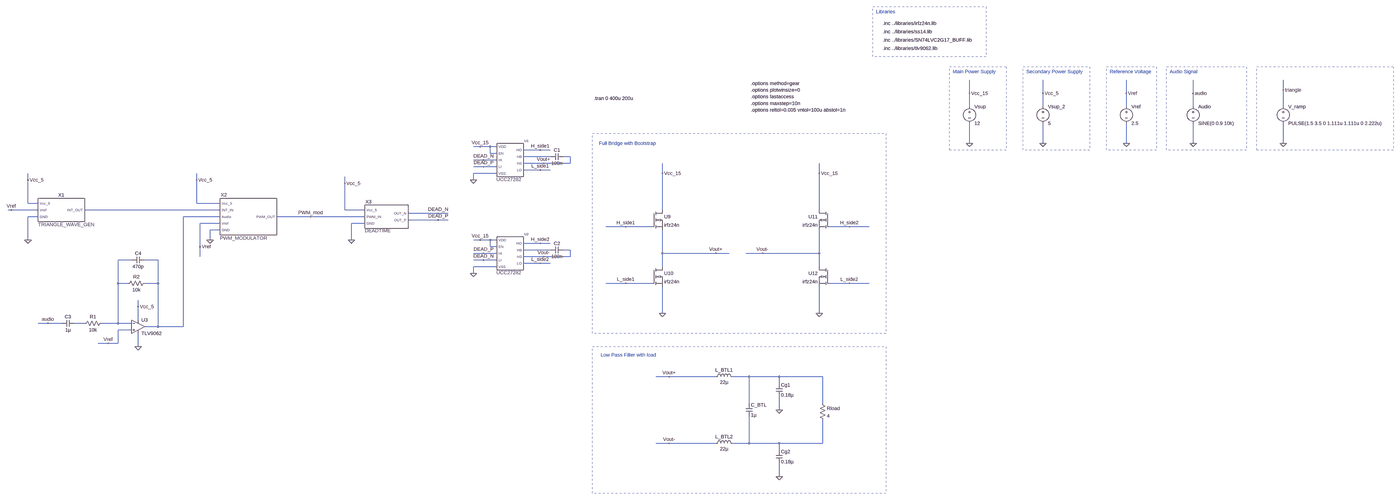
[diagram p0: schematic Top.asc, whole sheet]
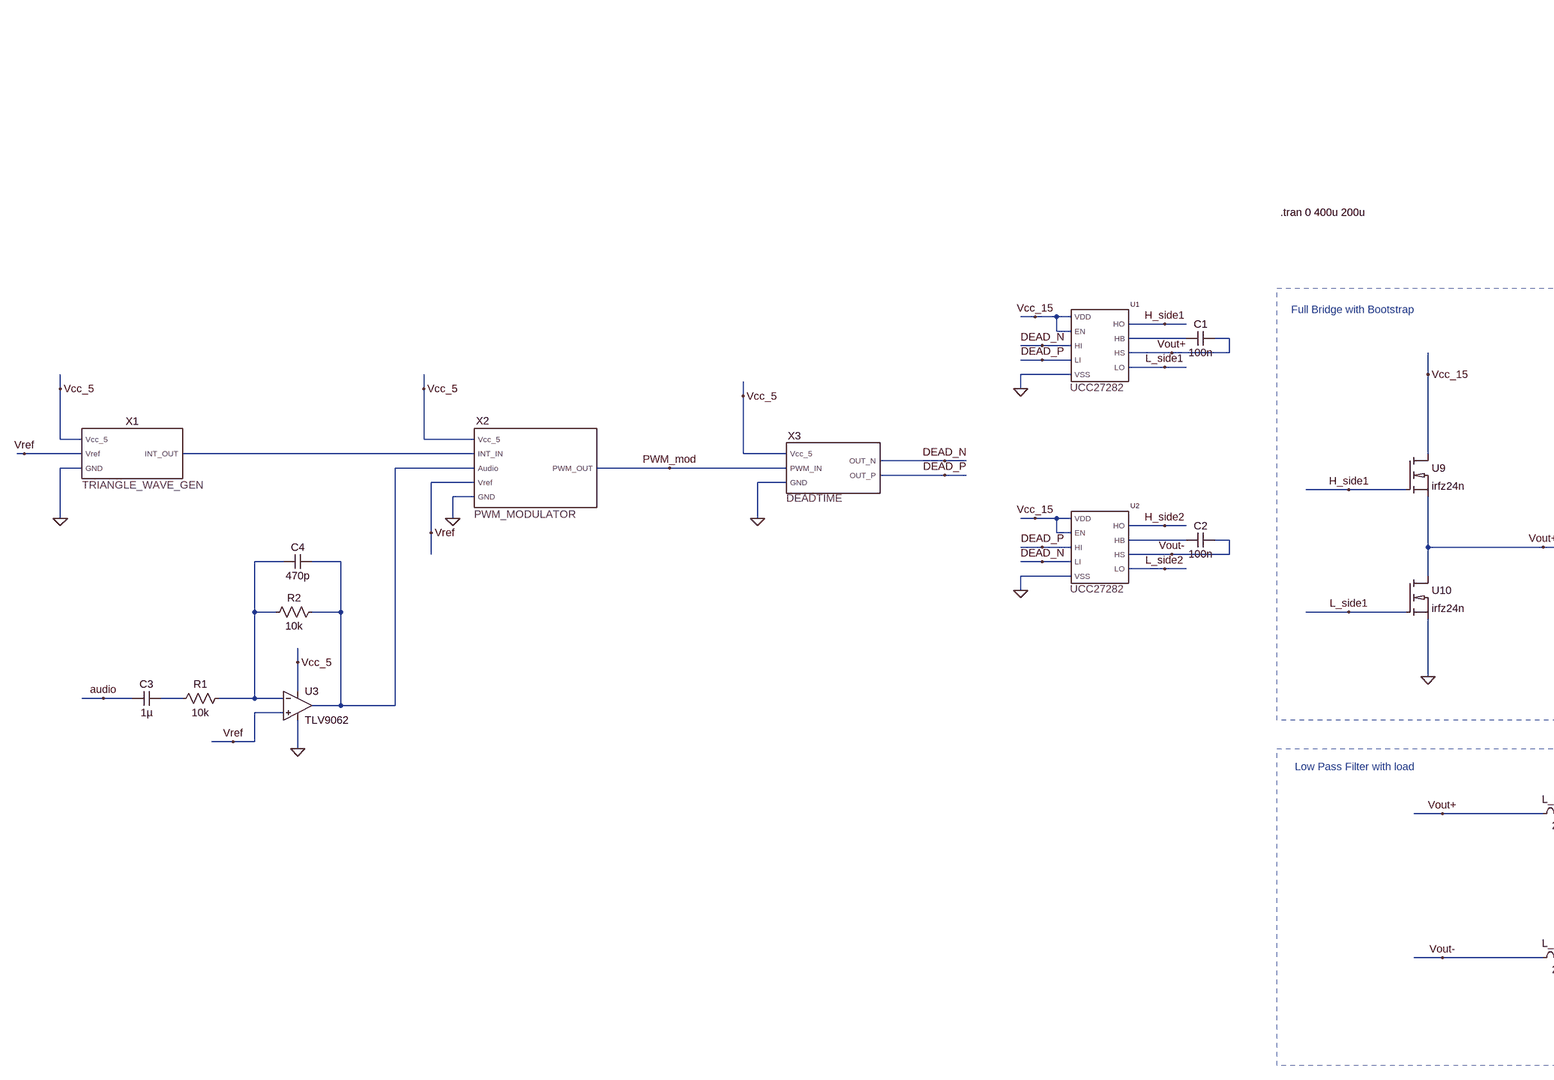
[diagram p1: schematic Top.asc, part, row 1 of 1, column 1 of 2]
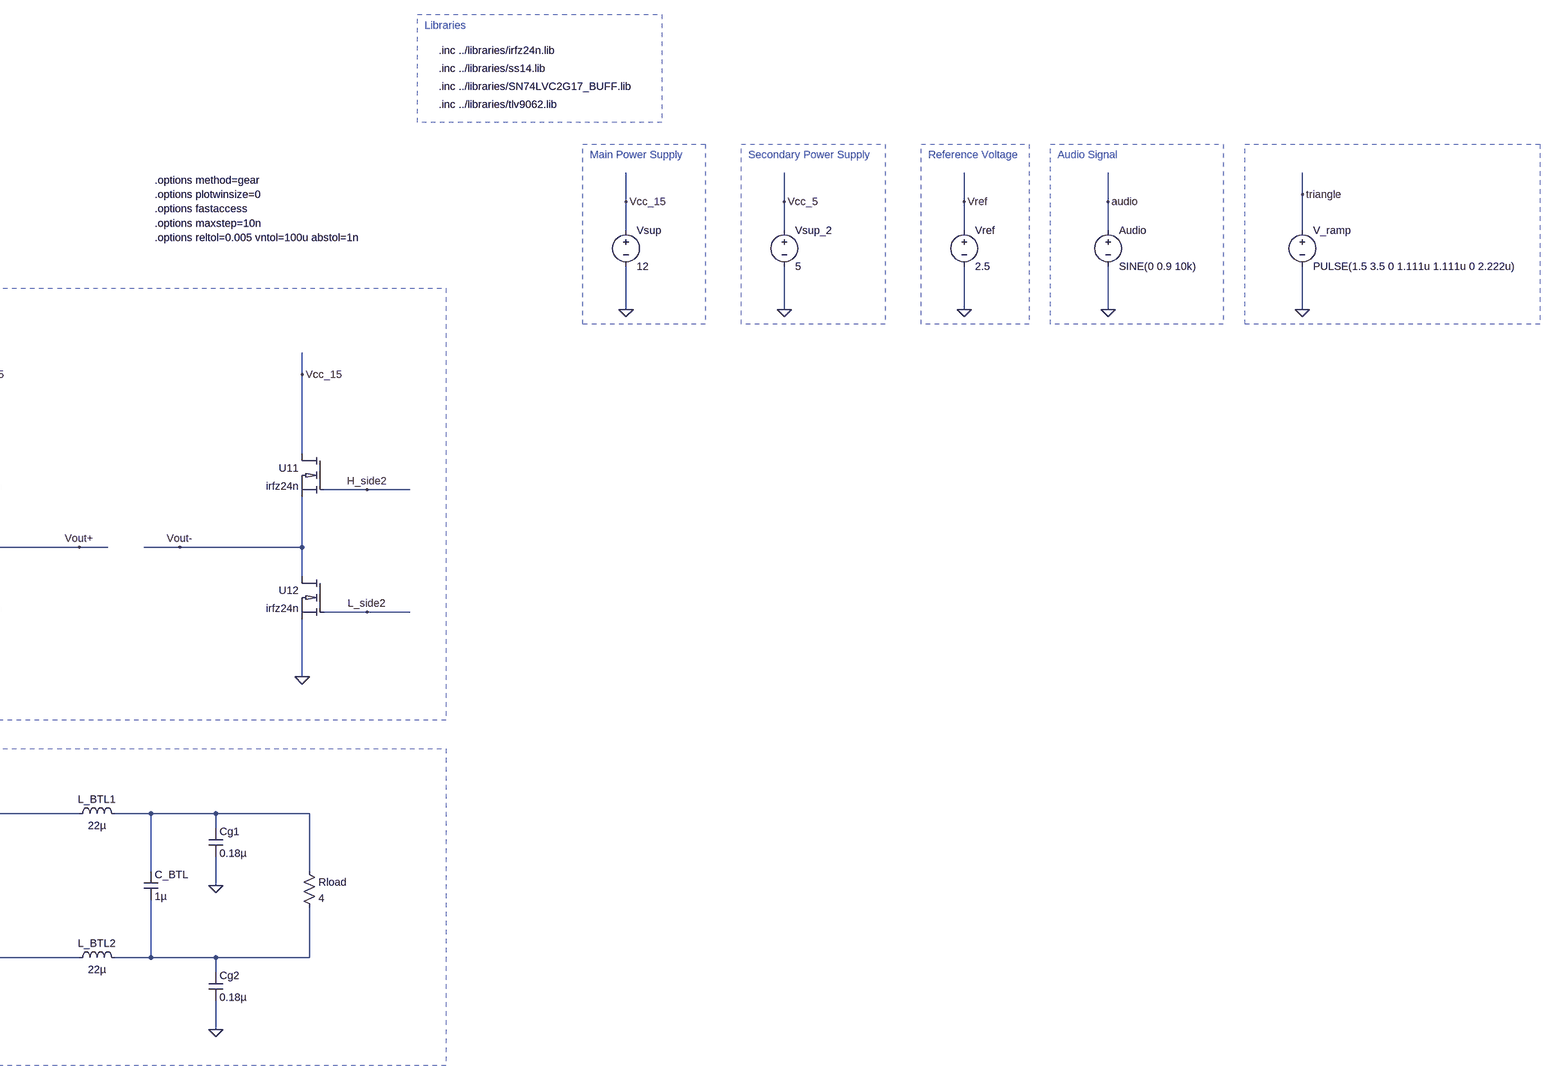
[diagram p2: schematic Top.asc, part, row 1 of 1, column 2 of 2]
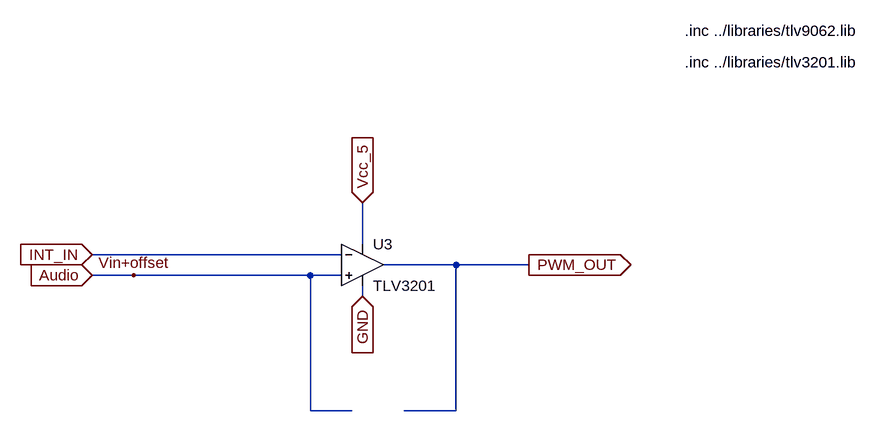
[diagram p3: sub-circuit pwm_modulator_component.asc]
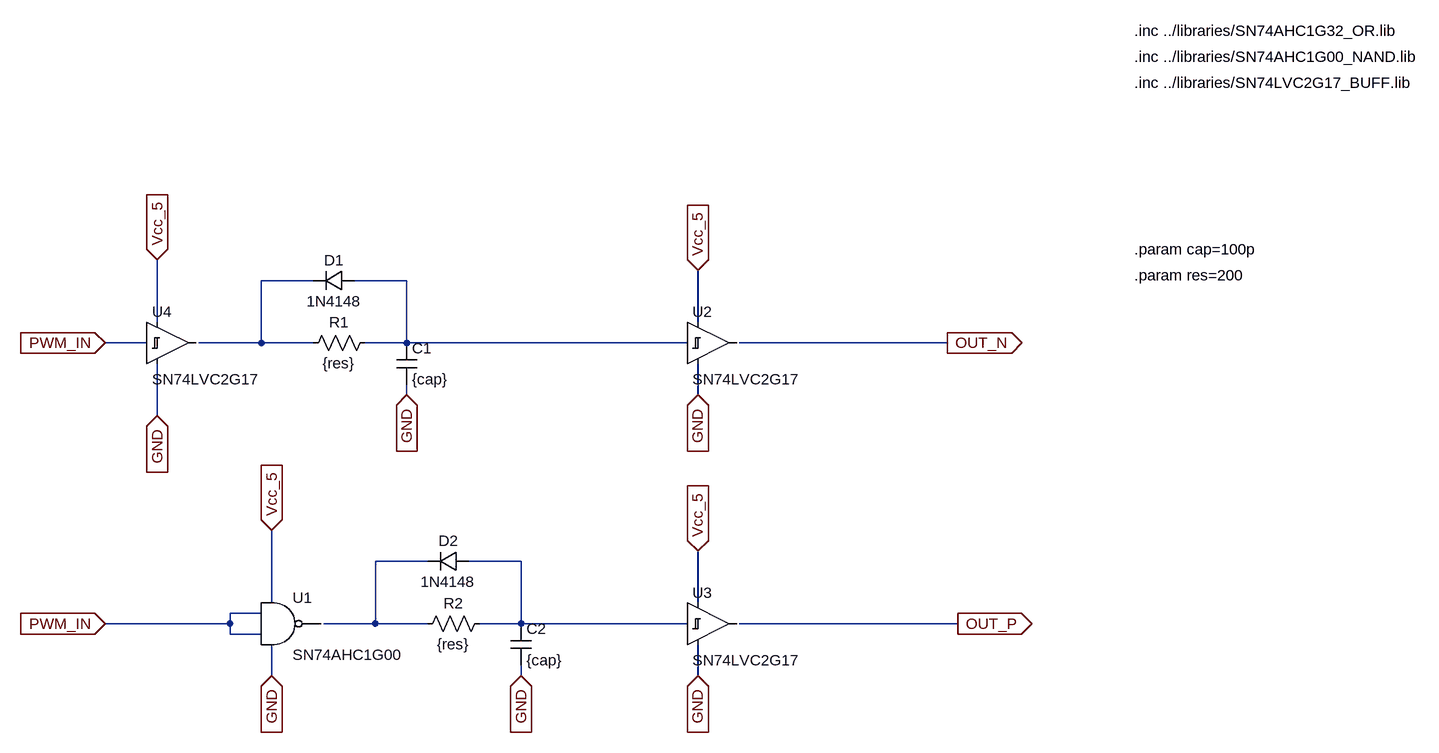
[diagram p4: sub-circuit deadtime_component.asc]
Top.asc, the LTspice schematic file:
Version 4
SHEET 1 4788 2420
WIRE 4256 304 4256 256
WIRE 2752 320 2752 256
WIRE 3104 320 3104 256
WIRE 3504 320 3504 256
WIRE 3824 320 3824 256
WIRE 2752 384 2752 320
WIRE 3104 384 3104 320
WIRE 3504 384 3504 320
WIRE 3824 384 3824 320
WIRE 4256 384 4256 304
WIRE 2752 560 2752 464
WIRE 3104 560 3104 464
WIRE 3504 560 3504 464
WIRE 3824 560 3824 464
WIRE 4256 560 4256 464
WIRE 368 576 336 576
WIRE 416 576 368 576
WIRE 448 576 416 576
WIRE 656 592 576 592
WIRE 704 592 656 592
WIRE 416 608 416 576
WIRE 448 608 416 608
WIRE 704 624 576 624
WIRE 800 624 768 624
WIRE 384 640 336 640
WIRE 448 640 384 640
WIRE 672 656 576 656
WIRE 800 656 800 624
WIRE 800 656 672 656
WIRE 384 672 336 672
WIRE 448 672 384 672
WIRE 656 688 576 688
WIRE 704 688 656 688
WIRE 448 704 336 704
WIRE 1280 704 1280 656
WIRE 2032 704 2032 656
WIRE -2208 736 -2208 704
WIRE -1216 736 -1216 704
WIRE 336 736 336 704
WIRE -336 752 -336 720
WIRE -2208 848 -2208 736
WIRE -2160 848 -2208 848
WIRE -1216 848 -1216 736
WIRE -1104 848 -1216 848
WIRE -2288 880 -2304 880
WIRE -2160 880 -2288 880
WIRE -1104 880 -1936 880
WIRE -336 880 -336 752
WIRE -240 880 -336 880
WIRE 1280 880 1280 704
WIRE 2032 880 2032 704
WIRE 112 896 -32 896
WIRE 160 896 112 896
WIRE -2160 912 -2208 912
WIRE -1104 912 -1280 912
WIRE -528 912 -832 912
WIRE -240 912 -528 912
WIRE 112 928 -32 928
WIRE 160 928 112 928
WIRE -1104 944 -1200 944
WIRE -240 944 -304 944
WIRE 1104 960 1008 960
WIRE 1232 960 1104 960
WIRE 2176 960 2080 960
WIRE 2272 960 2176 960
WIRE -1104 976 -1152 976
WIRE -2208 1024 -2208 912
WIRE -1152 1024 -1152 976
WIRE -304 1024 -304 944
WIRE 368 1024 336 1024
WIRE 416 1024 368 1024
WIRE 448 1024 416 1024
WIRE 656 1040 576 1040
WIRE 704 1040 656 1040
WIRE -1200 1056 -1200 944
WIRE 416 1056 416 1024
WIRE 448 1056 416 1056
WIRE 704 1072 576 1072
WIRE 800 1072 768 1072
WIRE 384 1088 336 1088
WIRE 448 1088 384 1088
WIRE 1280 1088 1280 976
WIRE 1536 1088 1280 1088
WIRE 1600 1088 1536 1088
WIRE 1760 1088 1680 1088
WIRE 2032 1088 2032 976
WIRE 2032 1088 1760 1088
WIRE -1200 1104 -1200 1056
WIRE 672 1104 576 1104
WIRE 800 1104 800 1072
WIRE 800 1104 672 1104
WIRE -1712 1120 -1776 1120
WIRE -1584 1120 -1648 1120
WIRE 384 1120 336 1120
WIRE 448 1120 384 1120
WIRE 656 1136 576 1136
WIRE 704 1136 656 1136
WIRE 448 1152 336 1152
WIRE 1280 1152 1280 1088
WIRE 2032 1152 2032 1088
WIRE 336 1184 336 1152
WIRE -1776 1232 -1776 1120
WIRE -1728 1232 -1776 1232
WIRE -1584 1232 -1584 1120
WIRE -1584 1232 -1648 1232
WIRE 1104 1232 1008 1232
WIRE 1232 1232 1104 1232
WIRE 2176 1232 2080 1232
WIRE 2272 1232 2176 1232
WIRE -1680 1344 -1680 1312
WIRE 1280 1376 1280 1248
WIRE 2032 1376 2032 1248
WIRE -1680 1408 -1680 1344
WIRE -2112 1424 -2160 1424
WIRE -2048 1424 -2112 1424
WIRE -1936 1424 -1984 1424
WIRE -1776 1424 -1776 1232
WIRE -1776 1424 -1856 1424
WIRE -1712 1424 -1776 1424
WIRE -1584 1440 -1584 1232
WIRE -1584 1440 -1648 1440
WIRE -1280 1440 -1280 912
WIRE -1280 1440 -1584 1440
WIRE -1712 1456 -1776 1456
WIRE -1824 1520 -1872 1520
WIRE -1776 1520 -1776 1456
WIRE -1776 1520 -1824 1520
WIRE -1680 1536 -1680 1472
WIRE 1312 1680 1248 1680
WIRE 1536 1680 1312 1680
WIRE 1696 1680 1616 1680
WIRE 1840 1680 1696 1680
WIRE 2048 1680 1840 1680
WIRE 1840 1712 1840 1680
WIRE 1696 1808 1696 1680
WIRE 2048 1808 2048 1680
WIRE 1840 1840 1840 1776
WIRE 1312 2000 1248 2000
WIRE 1536 2000 1312 2000
WIRE 1696 2000 1696 1872
WIRE 1696 2000 1616 2000
WIRE 1840 2000 1696 2000
WIRE 2048 2000 2048 1888
WIRE 2048 2000 1840 2000
WIRE 1840 2032 1840 2000
WIRE 1840 2160 1840 2096
FLAG 1280 1376 0
FLAG 2032 1376 0
FLAG 1280 704 Vcc_15
FLAG 2032 704 Vcc_15
FLAG 2752 560 0
FLAG 2752 320 Vcc_15
FLAG 1104 960 H_side1
FLAG 1104 1232 L_side1
FLAG 2176 960 H_side2
FLAG 2176 1232 L_side2
FLAG 3104 560 0
FLAG 3104 320 Vcc_5
FLAG -1216 736 Vcc_5
FLAG 3504 560 0
FLAG 3504 320 Vref
FLAG -1200 1056 Vref
FLAG -336 752 Vcc_5
FLAG 3824 560 0
FLAG 3824 320 audio
FLAG -1152 1024 0
FLAG -304 1024 0
FLAG -528 912 PWM_mod
FLAG 112 896 DEAD_N
FLAG 112 928 DEAD_P
FLAG 1536 1088 Vout+
FLAG 1760 1088 Vout-
FLAG 1840 1840 0
FLAG 1840 2160 0
FLAG 1312 1680 Vout+
FLAG 1312 2000 Vout-
FLAG 4256 560 0
FLAG 4256 304 triangle
FLAG 336 1184 0
FLAG 336 736 0
FLAG 368 576 Vcc_15
FLAG 368 1024 Vcc_15
FLAG 656 592 H_side1
FLAG 656 688 L_side1
FLAG 656 1040 H_side2
FLAG 656 1136 L_side2
FLAG 384 640 DEAD_N
FLAG 384 1120 DEAD_N
FLAG 384 672 DEAD_P
FLAG 384 1088 DEAD_P
FLAG 672 656 Vout+
FLAG 672 1104 Vout-
FLAG -1680 1536 0
FLAG -1680 1344 Vcc_5
FLAG -1824 1520 Vref
FLAG -2112 1424 audio
FLAG -2208 1024 0
FLAG -2208 736 Vcc_5
FLAG -2288 880 Vref
SYMBOL irfz24n 1232 880 R0
SYMATTR InstName U9
SYMBOL irfz24n 1232 1152 R0
SYMATTR InstName U10
SYMBOL irfz24n 2080 880 M0
SYMATTR InstName U11
SYMBOL irfz24n 2080 1152 M0
SYMATTR InstName U12
SYMBOL voltage 2752 368 R0
WINDOW 123 0 0 Left 0
WINDOW 39 0 0 Left 0
SYMATTR InstName Vsup
SYMATTR Value 12
SYMBOL PWM_modulator_component -992 912 R0
WINDOW 0 -93 -89 Bottom 2
SYMATTR InstName X2
SYMBOL Deadtime_component -144 912 R0
WINDOW 0 -78 -56 Bottom 2
SYMATTR InstName X3
SYMBOL voltage 3104 368 R0
WINDOW 123 0 0 Left 0
WINDOW 39 0 0 Left 0
SYMATTR InstName Vsup_2
SYMATTR Value 5
SYMBOL voltage 3504 368 R0
WINDOW 123 0 0 Left 0
WINDOW 39 0 0 Left 0
SYMATTR InstName Vref
SYMATTR Value 2.5
SYMBOL voltage 3824 368 R0
WINDOW 123 0 0 Left 0
WINDOW 39 0 0 Left 0
SYMATTR InstName Audio
SYMATTR Value SINE(0 0.9 10k)
SYMBOL ind 1520 1696 R270
WINDOW 0 32 56 VTop 2
WINDOW 3 5 56 VBottom 2
SYMATTR InstName L_BTL1
SYMATTR Value 22µ
SYMATTR SpiceLine Rser=0.1
SYMBOL cap 1824 1712 R0
SYMATTR InstName Cg1
SYMATTR Value 0.18µ
SYMATTR SpiceLine Rser=0.01
SYMBOL ind 1520 2016 R270
WINDOW 0 32 56 VTop 2
WINDOW 3 5 56 VBottom 2
SYMATTR InstName L_BTL2
SYMATTR Value 22µ
SYMATTR SpiceLine Rser=0.1
SYMBOL cap 1824 2032 R0
SYMATTR InstName Cg2
SYMATTR Value 0.18µ
SYMATTR SpiceLine Rser=0.01
SYMBOL cap 1680 1808 R0
SYMATTR InstName C_BTL
SYMATTR Value 1µ
SYMATTR SpiceLine Rser=0.1
SYMBOL res 2032 1792 R0
SYMATTR InstName Rload
SYMATTR Value 4
SYMBOL voltage 4256 368 R0
WINDOW 123 0 0 Left 0
WINDOW 39 0 0 Left 0
SYMATTR InstName V_ramp
SYMATTR Value PULSE(1.5 3.5 0 1.111u 1.111u 0 2.222u)
SYMBOL UCC27282 512 1088 R0
SYMATTR InstName U2
SYMBOL UCC27282 512 640 R0
SYMATTR InstName U1
SYMBOL cap 768 608 R90
WINDOW 0 0 32 VBottom 2
WINDOW 3 32 32 VTop 2
SYMATTR InstName C1
SYMATTR Value 100n
SYMBOL cap 768 1056 R90
WINDOW 0 0 32 VBottom 2
WINDOW 3 32 32 VTop 2
SYMATTR InstName C2
SYMATTR Value 100n
SYMBOL OpAmps\\opamp2 -1680 1376 R0
SYMATTR InstName U3
SYMATTR Value TLV9062
SYMBOL res -1840 1408 R90
WINDOW 0 0 56 VBottom 2
WINDOW 3 32 56 VTop 2
SYMATTR InstName R1
SYMATTR Value 10k
SYMBOL cap -1984 1408 R90
WINDOW 0 0 32 VBottom 2
WINDOW 3 32 32 VTop 2
SYMATTR InstName C3
SYMATTR Value 1µ
SYMBOL res -1632 1216 R90
WINDOW 0 0 56 VBottom 2
WINDOW 3 32 56 VTop 2
SYMATTR InstName R2
SYMATTR Value 10k
SYMBOL cap -1648 1104 R90
WINDOW 0 0 32 VBottom 2
WINDOW 3 32 32 VTop 2
SYMATTR InstName C4
SYMATTR Value 470p
SYMBOL triangle_wave_gen -2048 880 R0
SYMATTR InstName X1
TEXT 2336 -16 Left 2 !.inc ../libraries/irfz24n.lib
TEXT 2336 24 Left 2 !.inc ../libraries/ss14.lib
TEXT 976 560 Left 2 ;Full Bridge with Bootstrap
TEXT 2672 216 Left 2 ;Main Power Supply
TEXT 2304 -72 Left 2 ;Libraries
TEXT 952 344 Left 2 !.tran 0 400u 200u
TEXT 3024 216 Left 2 ;Secondary Power Supply
TEXT 3424 216 Left 2 ;Reference Voltage
TEXT 3712 216 Left 2 ;Audio Signal
TEXT 2336 64 Left 2 !.inc ../libraries/SN74LVC2G17_BUFF.lib
TEXT 2336 104 Left 2 !.inc ../libraries/tlv9062.lib
TEXT 984 1576 Left 2 ;Low Pass Filter with load
TEXT 1704 272 Left 2 !.options method=gear
TEXT 1704 304 Left 2 !.options plotwinsize=0
TEXT 1704 336 Left 2 !.options fastaccess
TEXT 1704 368 Left 2 !.options maxstep=10n
TEXT 1704 400 Left 2 !.options reltol=0.005 vntol=100u abstol=1n
RECTANGLE Normal 2352 1472 944 512 2
RECTANGLE Normal 2928 592 2656 192 2
RECTANGLE Normal 2832 144 2288 -96 2
RECTANGLE Normal 3328 592 3008 192 2
RECTANGLE Normal 3648 592 3408 192 2
RECTANGLE Normal 4080 592 3696 192 2
RECTANGLE Normal 2352 2240 944 1536 2
RECTANGLE Normal 4784 592 4128 192 2

pwm_modulator_component.asc, the sub-circuit schematic file:
Version 4
SHEET 1 1432 836
WIRE 48 288 48 224
WIRE 16 304 -368 304
WIRE 192 320 80 320
WIRE 304 320 192 320
WIRE -304 336 -368 336
WIRE -32 336 -304 336
WIRE 16 336 -32 336
WIRE 48 368 48 352
WIRE -32 544 -32 336
WIRE 32 544 -32 544
WIRE 192 544 192 320
WIRE 192 544 112 544
FLAG 48 224 Vcc_5
IOPIN 48 224 In
FLAG -368 304 INT_IN
IOPIN -368 304 In
FLAG -368 336 Audio
IOPIN -368 336 In
FLAG 304 320 PWM_OUT
IOPIN 304 320 Out
FLAG -304 336 Vin+offset
FLAG 48 368 GND
IOPIN 48 368 In
SYMBOL OpAmps\\opamp2 48 256 R0
SYMATTR InstName U3
SYMATTR Value TLV3201
TEXT 544 -40 Left 2 !.inc ../libraries/tlv9062.lib
TEXT 544 8 Left 2 !.inc ../libraries/tlv3201.lib

deadtime_component.asc, the sub-circuit schematic file:
Version 4
SHEET 1 1604 848
WIRE -640 80 -720 80
WIRE -496 80 -576 80
WIRE -880 144 -880 48
WIRE -48 144 -48 64
WIRE -896 176 -960 176
WIRE -720 176 -720 80
WIRE -720 176 -816 176
WIRE -640 176 -720 176
WIRE -496 176 -496 80
WIRE -496 176 -560 176
WIRE -64 176 -496 176
WIRE 336 176 16 176
WIRE -496 256 -496 240
WIRE -48 256 -48 208
WIRE -880 288 -880 208
WIRE -464 512 -544 512
WIRE -320 512 -400 512
WIRE -704 576 -704 464
WIRE -48 576 -48 496
WIRE -720 592 -768 592
WIRE -768 608 -768 592
WIRE -768 608 -960 608
WIRE -544 608 -544 512
WIRE -544 608 -624 608
WIRE -464 608 -544 608
WIRE -320 608 -320 512
WIRE -320 608 -384 608
WIRE -64 608 -320 608
WIRE 352 608 16 608
WIRE -768 624 -768 608
WIRE -720 624 -768 624
WIRE -704 688 -704 640
WIRE -320 688 -320 672
WIRE -48 688 -48 640
FLAG 352 608 OUT_P
IOPIN 352 608 Out
FLAG 336 176 OUT_N
IOPIN 336 176 Out
FLAG -960 608 PWM_IN
IOPIN -960 608 In
FLAG -496 256 GND
IOPIN -496 256 In
FLAG -960 176 PWM_IN
IOPIN -960 176 In
FLAG -320 688 GND
IOPIN -320 688 In
FLAG -48 688 GND
IOPIN -48 688 In
FLAG -48 256 GND
IOPIN -48 256 In
FLAG -48 64 Vcc_5
IOPIN -48 64 In
FLAG -48 496 Vcc_5
IOPIN -48 496 In
FLAG -704 464 Vcc_5
IOPIN -704 464 In
FLAG -704 688 GND
IOPIN -704 688 In
FLAG -880 48 Vcc_5
IOPIN -880 48 In
FLAG -880 288 GND
IOPIN -880 288 In
SYMBOL res -544 160 R90
WINDOW 0 0 56 VBottom 2
WINDOW 3 32 56 VTop 2
SYMATTR InstName R1
SYMATTR Value {res}
SYMBOL cap -512 176 R0
SYMATTR InstName C1
SYMATTR Value {cap}
SYMBOL diode -576 64 R90
WINDOW 0 0 32 VBottom 2
WINDOW 3 32 32 VTop 2
SYMATTR InstName D1
SYMATTR Value 1N4148
SYMBOL res -368 592 R90
WINDOW 0 0 56 VBottom 2
WINDOW 3 32 56 VTop 2
SYMATTR InstName R2
SYMATTR Value {res}
SYMBOL cap -336 608 R0
SYMATTR InstName C2
SYMATTR Value {cap}
SYMBOL diode -400 496 R90
WINDOW 0 0 32 VBottom 2
WINDOW 3 32 32 VTop 2
SYMATTR InstName D2
SYMATTR Value 1N4148
SYMBOL my_nand -688 544 R0
SYMATTR InstName U1
SYMBOL schmitt_buffer -64 112 R0
SYMATTR InstName U2
SYMBOL schmitt_buffer -64 544 R0
SYMATTR InstName U3
SYMBOL schmitt_buffer -896 112 R0
SYMATTR InstName U4
TEXT 624 -304 Left 2 !.inc ../libraries/SN74AHC1G32_OR.lib
TEXT 624 -264 Left 2 !.inc ../libraries/SN74AHC1G00_NAND.lib
TEXT 624 -224 Left 2 !.inc ../libraries/SN74LVC2G17_BUFF.lib
TEXT 624 32 Left 2 !.param cap=100p
TEXT 624 72 Left 2 !.param res=200

The netlist it stands for:
* Top.asc
XU9 Vcc_15 H_side1 Vout+ irfz24n  ; pins D G S
XU10 Vout+ L_side1 0 irfz24n  ; pins D G S
XU11 Vcc_15 H_side2 Vout- irfz24n  ; pins D G S
XU12 Vout- L_side2 0 irfz24n  ; pins D G S
Vsup Vcc_15 0 12
XX2 N003 0 N002 Vcc_5 Vref PWM_mod pwm_modulator_component
XX3 0 PWM_mod Vcc_5 DEAD_N DEAD_P deadtime_component
Vsup_2 Vcc_5 0 5
Vref Vref 0 2.5
V§Audio audio 0 SINE(0 0.9 10k)
L_BTL1 Vout+ N007 22µ Rser=0.1
Cg1 N007 0 0.18µ Rser=0.01
L_BTL2 Vout- N008 22µ Rser=0.1
Cg2 N008 0 0.18µ Rser=0.01
C_BTL N007 N008 1µ Rser=0.1
Rload N007 N008 4
V_ramp triangle 0 PULSE(1.5 3.5 0 1.111u 1.111u 0 2.222u)
XU2 DEAD_N DEAD_P Vcc_15 Vcc_15 0 N004 H_side2 Vout- L_side2 UCC27282 UCC27282  ; pins LI HI EN VDD VSS HB HO HS LO
XU1 DEAD_P DEAD_N Vcc_15 Vcc_15 0 N001 H_side1 Vout+ L_side1 UCC27282 UCC27282  ; pins LI HI EN VDD VSS HB HO HS LO
C1 Vout+ N001 100n
C2 Vout- N004 100n
XU3 Vref N005 Vcc_5 0 N003 TLV9062  ; pins In+ In- V+ V- OUT
R1 N005 N006 10k
C3 N006 audio 1µ
R2 N003 N005 10k
C4 N003 N005 470p
XX1 Vcc_5 Vref 0 N002 triangle_wave_gen  ; pins Vcc_5 Vref GND INT_OUT

* block symbol definitions
.subckt pwm_modulator_component Audio GND INT_IN Vcc_5 Vref PWM_OUT
XU3 Audio INT_IN Vcc_5 GND PWM_OUT TLV3201  ; pins In+ In- V+ V- OUT
.inc ../libraries/tlv9062.lib
.inc ../libraries/tlv3201.lib
.ends pwm_modulator_component

.subckt deadtime_component GND PWM_IN Vcc_5 OUT_N OUT_P
R1 N002 N001 {res}
C1 N002 GND {cap}
D1 N002 N001 1N4148
R2 N004 N003 {res}
C2 N004 GND {cap}
D2 N004 N003 1N4148
XU1 N003 PWM_IN PWM_IN Vcc_5 GND SN74AHC1G00  ; pins Y A B VCC AGND
XU2 OUT_N N002 Vcc_5 GND SN74LVC2G17  ; pins Y A VCC AGND
XU3 OUT_P N004 Vcc_5 GND SN74LVC2G17  ; pins Y A VCC AGND
XU4 N001 PWM_IN Vcc_5 GND SN74LVC2G17  ; pins Y A VCC AGND
.inc ../libraries/SN74AHC1G32_OR.lib
.inc ../libraries/SN74AHC1G00_NAND.lib
.inc ../libraries/SN74LVC2G17_BUFF.lib
.param cap=100p
.param res=200
.ends deadtime_component

.model D D
.lib standard.dio
.inc ../libraries/irfz24n.lib
.inc ../libraries/ss14.lib
* Full Bridge with Bootstrap
* Main Power Supply
* Libraries
.tran 0 400u 200u
* Secondary Power Supply
* Reference Voltage
* Audio Signal
.inc ../libraries/SN74LVC2G17_BUFF.lib
.inc ../libraries/tlv9062.lib
* Low Pass Filter with load
.options method=gear
.options plotwinsize=0
.options fastaccess
.options maxstep=10n
.options reltol=0.005 vntol=100u abstol=1n
.lib ../libraries/ucc27282.lib
.backanno
.end